# Altium schematic sheet CON_MINI_USBB_RA.SchDoc: USB 2.0 Type B Connector
size A4; Organization: Altium Limited.; Address1: Level 3, 12a Rodborough Rd; Address2: Frenchs Forest 2086; Address3: NSW; Address4: AUSTRALIA; Revision: 6; SheetNumber: 57; SheetTotal: 64
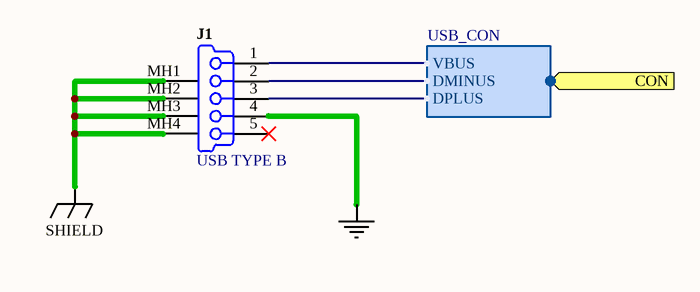
[diagram p0: CON_MINI_USBB_RA.SchDoc]

## Parts
J1  USB TYPE B  [USB-MOLEX-675031020]

## Ports
CON (harness USB_CON)

## Harnesses
USB_CON: VBUS, DMINUS, DPLUS

## Nets
GND: J1.4
SHIELD: J1.MH1 J1.MH2 J1.MH3 J1.MH4
NetJ1_1: J1.1 ; port CON.VBUS
NetJ1_2: J1.2 ; port CON.DMINUS
NetJ1_3: J1.3 ; port CON.DPLUS

Not connected (* = marked no-connect by the designer): J1 5*

## Notes on the sheet
- Sheet Title
- Project Title
- Size:
- Date:
- A4
- Assy:
- Time:
- Sheet
- Revision:
- of
- File:

## Library data of the parts
J1 = D-300-0009: USB, SMD, Type B, Molex; Connector type: Right Angle; Max Current: mA; Category: Connector; Mounting Technology: Surface Mount; Status: Production